# Altium schematic sheet I2C.SchDoc: I2C
size A4; Date: 04/19/2026; Author: Lanfroid-Nazac Guillaume; DrawnBy: Lanfroid-Nazac Guillaume; Revision: v1.0; SheetNumber: 2; SheetTotal: 7
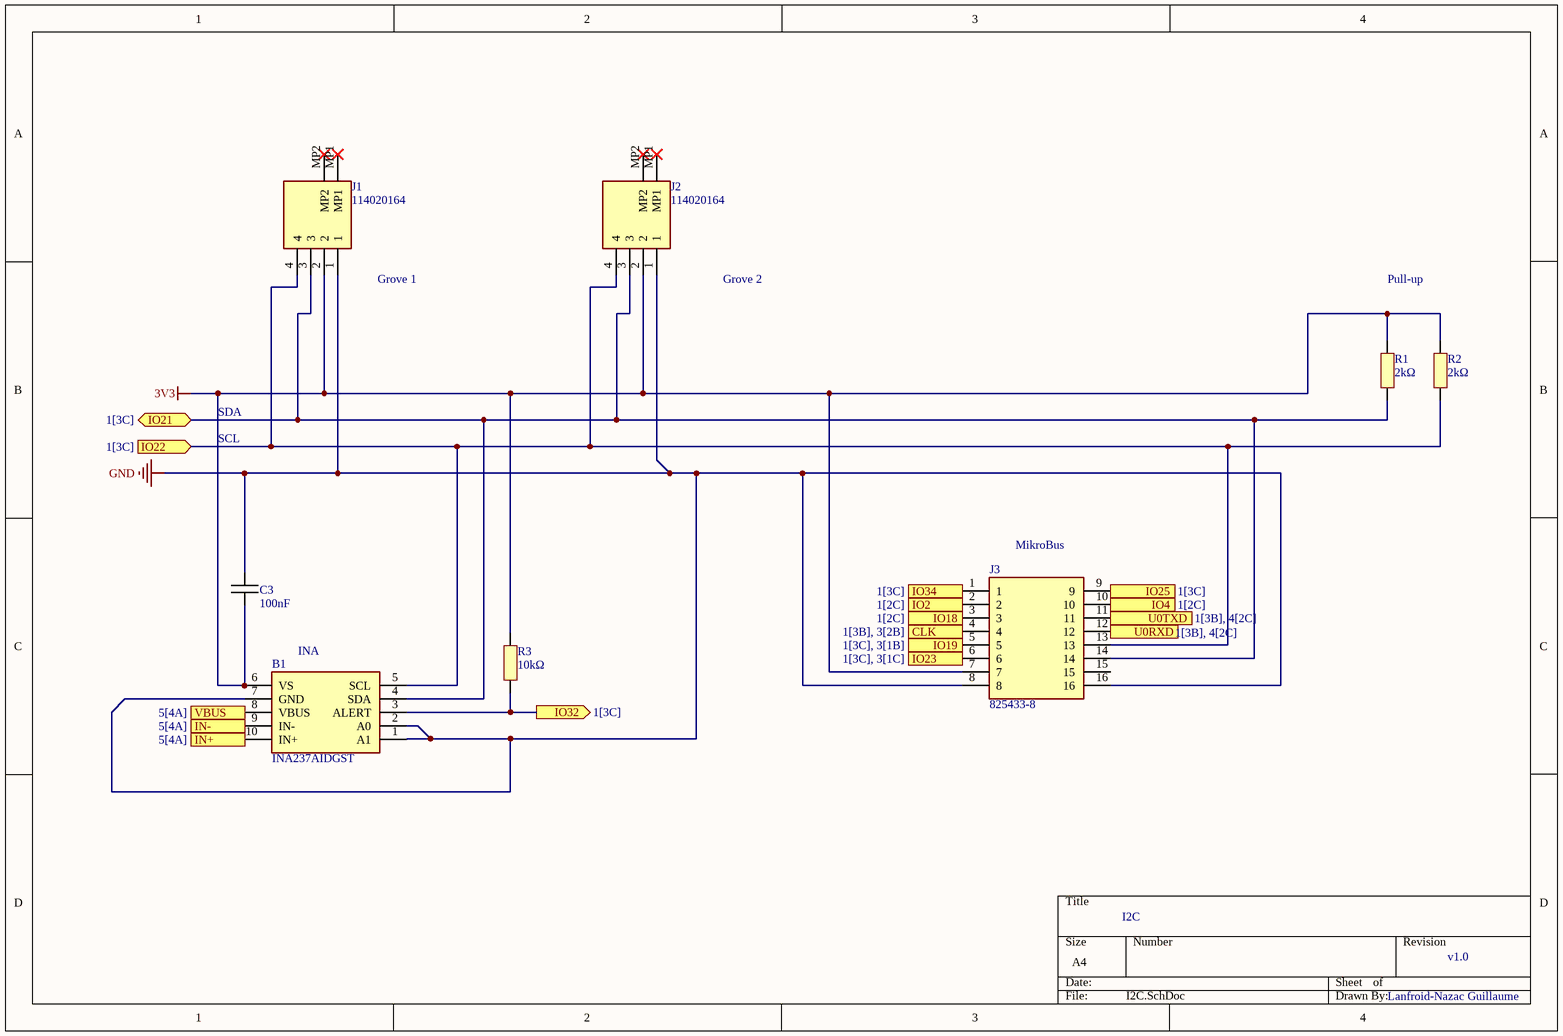
[diagram p0: I2C.SchDoc]

## Parts
B1  INA237AIDGST  [SOP50P490X110-10N]
C3  100nF  [CAPC1005X06N]
J1  114020164  [114020164]
J2  114020164  [114020164]
J3  825433-8  [Connect-Mikrobus]
R1  2kΩ  [RESC1005X06N]
R2  2kΩ  [RESC1005X06N]
R3  10kΩ  [RESC1005X06N]

## Ports
CLK (in, see 1[3B], 3[2B]), IN+ (in, see 5[4A]), IN- (in, see 5[4A]), IO2 (out, see 1[2C]), IO4 (in, see 1[2C]), IO18 (out, see 1[2C]), IO19 (in, see 1[3C], 3[1B]), IO21 (bidir, see 1[3C]), IO22 (in, see 1[3C]), IO23 (out, see 1[3C], 3[1C]), IO25 (out, see 1[3C]), IO32 (out, see 1[3C]), IO34 (in, see 1[3C]), U0RXD (out, see 1[3B], 4[2C]), U0TXD (in, see 1[3B], 4[2C]), VBUS (in, see 5[4A])

## Nets
3V3: B1.6(VS) C3.1 J1.2 J2.2 J3.7 R1.1 R2.1 R3.1
GND: B1.1(A1) B1.2(A0) B1.7(GND) C3.2 J1.1 J2.1 J3.8 J3.16
CLK: J3.4 ; port CLK
IN+: B1.10(IN+) ; port IN+
IN-: B1.9(IN-) ; port IN-
IO2: J3.2 ; port IO2
IO4: J3.10 ; port IO4
IO18: J3.3 ; port IO18
IO19: J3.5 ; port IO19
IO21: B1.4(SDA) J1.3 J2.3 J3.14 R1.2 ; port IO21
IO22: B1.5(SCL) J1.4 J2.4 J3.13 R2.2 ; port IO22
IO23: J3.6 ; port IO23
IO25: J3.9 ; port IO25
IO32: B1.3(ALERT) R3.2 ; port IO32
IO34: J3.1 ; port IO34
U0RXD: J3.12 ; port U0RXD
U0TXD: J3.11 ; port U0TXD
VBUS: B1.8(VBUS) ; port VBUS

Not connected (* = marked no-connect by the designer): J1 MP1* MP2*; J2 MP1* MP2*; J3 15

## Notes on the sheet
- (near J1) Grove 1
- Grove 2
- Pull-up
- SDA
- SCL
- (near J3) MikroBus
- (near B1) INA

## Library data of the parts
B1 = INA237AIDGST: Current Sense Amplifiers 85-V, 16-bit, I2C output current/voltage/power monitor with alert 10-VSSOP -40 to 125; Manufacturer_Name: Texas Instruments; Manufacturer_Part_Number: INA237AIDGST; Mouser Part Number: 595-INA237AIDGST
C3 = Capacitor
J1 J2 = 114020164: Seeed Studio Accessories Grove Female Header - SMD-4P-2.0mm-90D-20Pcs; Manufacturer_Name: Seeed Studio; Manufacturer_Part_Number: 114020164; Mouser Part Number: 713-114020164
J3 = Connect-Mikrobus: Headers & Wire Housings 8P double for connection mikrobus; Manufacturer_Name: TE Connectivity; Manufacturer_Part_Number: 825433-8; Mouser Part Number: 571-825433-8
R1-R3 = Resistor